# Altium schematic sheet LEDS.SchDoc
size A
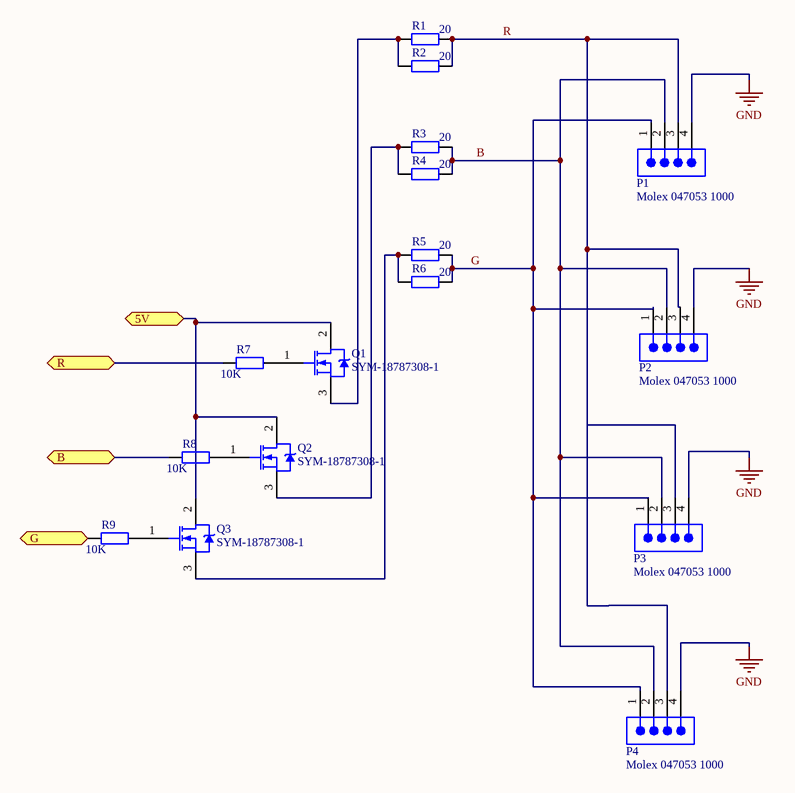
[diagram p0: LEDS.SchDoc]

## Parts
P1  Molex 047053 1000  [PCB-kyzvxp2nvgyimcljxmwn-1]
P2  Molex 047053 1000  [PCB-kyzvxp2nvgyimcljxmwn-1]
P3  Molex 047053 1000  [PCB-kyzvxp2nvgyimcljxmwn-1]
P4  Molex 047053 1000  [PCB-kyzvxp2nvgyimcljxmwn-1]
Q1  SYM-18787308-1  [PCB-18787308-1]
Q2  SYM-18787308-1  [PCB-18787308-1]
Q3  SYM-18787308-1  [PCB-18787308-1]
R1  Ohms: 20  [PCB-mctr3h3tvednl0z90ud0-1]  (hidden comment: Res2)
R2  Ohms: 20  [PCB-mctr3h3tvednl0z90ud0-1]  (hidden comment: Res2)
R3  Ohms: 20  [PCB-mctr3h3tvednl0z90ud0-1]  (hidden comment: Res2)
R4  Ohms: 20  [PCB-mctr3h3tvednl0z90ud0-1]  (hidden comment: Res2)
R5  Ohms: 20  [PCB-mctr3h3tvednl0z90ud0-1]  (hidden comment: Res2)
R6  Ohms: 20  [PCB-mctr3h3tvednl0z90ud0-1]  (hidden comment: Res2)
R7  Ohms: 10K  [PCB-mctr3h3tvednl0z90ud0-1]  (hidden comment: Res2)
R8  Ohms: 10K  [PCB-mctr3h3tvednl0z90ud0-1]  (hidden comment: Res2)
R9  Ohms: 10K  [PCB-mctr3h3tvednl0z90ud0-1]  (hidden comment: Res2)

## Ports
5V, B, G, R

## Nets
GND: P1.4 P2.4 P3.4 P4.4
5V: Q1.2(D) Q2.2(D) Q3.2(D) ; port 5V
B: R8.1 ; port B
B: P1.2 P2.2 P3.2 P4.2 R3.2 R4.2  [a separate net that carries the same name]
G: R9.1 ; port G
G: P1.1 P2.1 P3.1 P4.1 R5.2 R6.2  [a separate net that carries the same name]
R: R7.1 ; port R
R: P1.3 P2.3 P3.3 P4.3 R1.2 R2.2  [a separate net that carries the same name]
NetQ1_1: Q1.1(G) R7.2
NetQ1_3: Q1.3(S) R1.1 R2.1
NetQ2_1: Q2.1(G) R8.2
NetQ2_3: Q2.3(S) R3.1 R4.1
NetQ3_1: Q3.1(G) R9.2
NetQ3_3: Q3.3(S) R5.1 R6.1

## Library data of the parts
P1-P4 = CMP-d93b10f8176306fc-1: 2.54mm Pitch Vertical Header, with Friction Lock, 4 Circuits, PC Tail Length: 3.50mm; Lifecycle Status: Not Listed by Manufacturer; RoHS: Compliant; OctopartID: d93b10f8176306fc; Octopart URL: https://octopart.com/0470531000-molex-13232958
Q1-Q3 = CMP-18787308-5: MS; Part Family: IRFZ44N; Breakdown Voltage (Drain to Source): 55.0 V; Current Rating: 49.0 A; Rise Time: 60.0 ns; Gate Charge: 63.0 nC; Drain to Source Resistance (on) (Rds): 17.5 mΩ; Power Dissipation: 83.0 W; Input Capacitance: 1.47 nF; Lead-Free Status: Lead Free; Lifecycle Status: Active; Mounting Style: Through Hole; Octopart URL: http://octopart.com/irfz44npbf-international+rectifier-7371454; Continuous Drain Current (Ids): 49.0 A; OctopartID: 444b8d311b939b8c; Number of Pins: 3; Voltage Rating (DC): 55.0 V; REACH SVHC Compliance: No SVHC
R1-R9 = CMP-1413dd18cda2cbd4-1: Resistor; Carbon Composition; Res 3.9 Kilohms; Pwr-Rtg 0.25 W; Tol 5%; Axial; Manufacturer Part Number: OD392JE; Power Rating: 250 mW; Lead-Free Status: Lead Free; Mounting Style: Through Hole, Axial; OctopartID: 1413dd18cda2cbd4; Resistance Tolerance: ±5%; Size-Diameter: 2.50 mm